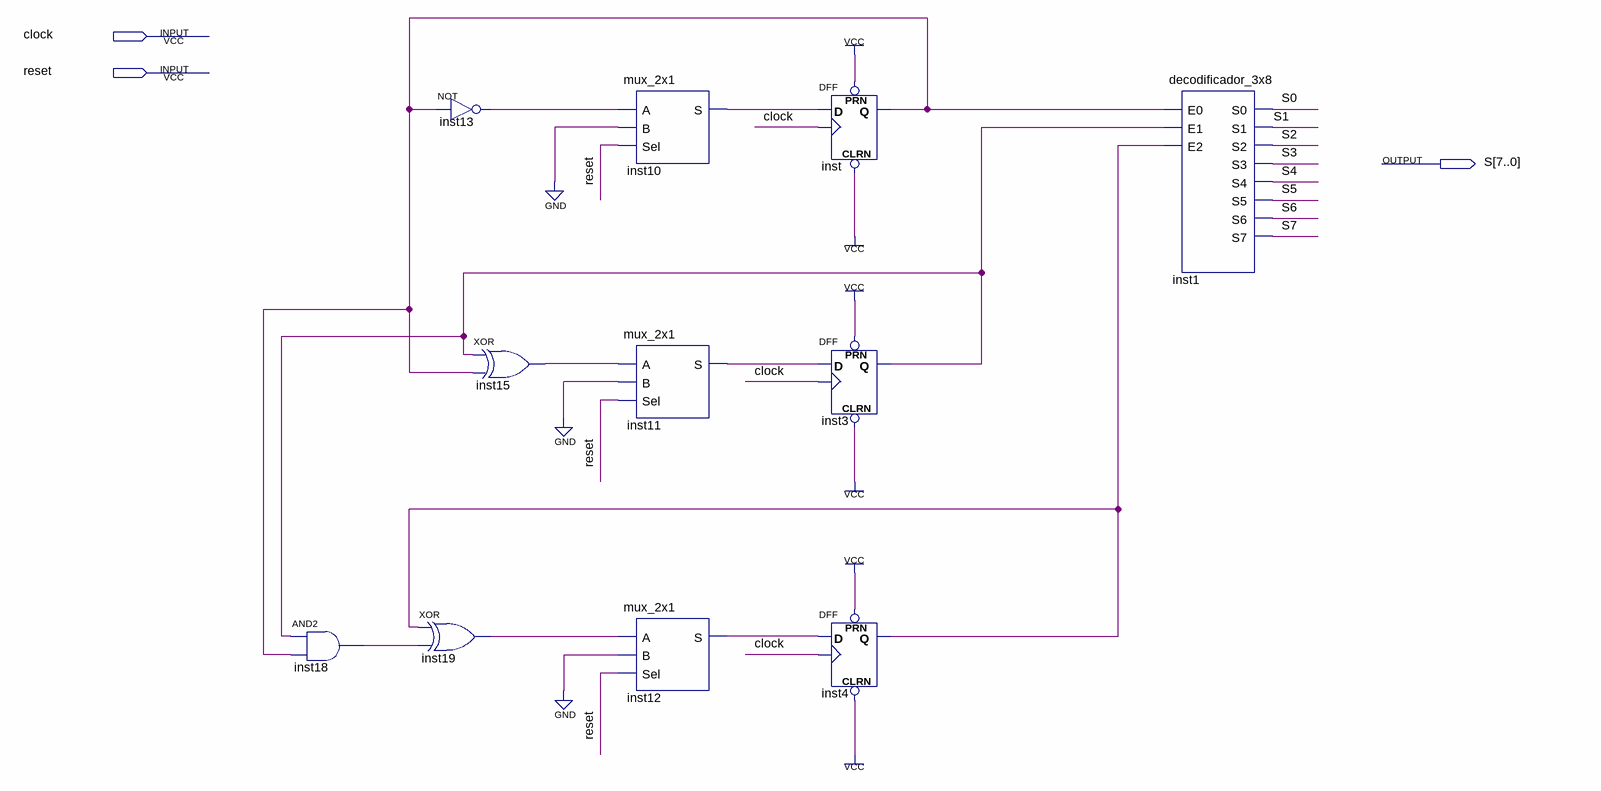
[diagram p0: schematic sheet]
// Quartus schematic temporizador.bdf as structural Verilog: 11 symbols, 3 pins
module temporizador (
  input  clock,
  input  reset,
  output [7:0] S
);

  wire inst3_q, inst4_q, inst10_s, inst11_s, inst12_s, inst13_out, inst15_out, inst18_out, inst19_out, inst_q;

  and inst18 (inst18_out, inst3_q, inst_q);
  not inst13 (inst13_out, inst_q);
  xor inst15 (inst15_out, inst3_q, inst_q);
  xor inst19 (inst19_out, inst4_q, inst18_out);
  mux_2x1 inst10 (.A(inst13_out), .B(1'b0), .Sel(reset), .S(inst10_s));
  mux_2x1 inst11 (.A(inst15_out), .B(1'b0), .Sel(reset), .S(inst11_s));
  mux_2x1 inst12 (.A(inst19_out), .B(1'b0), .Sel(reset), .S(inst12_s));
  DFF inst (.CLRN(1'b1), .CLK(clock), .D(inst10_s), .PRN(1'b1), .Q(inst_q));
  DFF inst3 (.CLRN(1'b1), .CLK(clock), .D(inst11_s), .PRN(1'b1), .Q(inst3_q));
  DFF inst4 (.CLRN(1'b1), .CLK(clock), .D(inst12_s), .PRN(1'b1), .Q(inst4_q));
  decodificador_3x8 inst1 (
    .E0(inst_q), .E1(inst3_q), .E2(inst4_q), .S0(S[0]), .S1(S[1]), .S2(S[2]), .S3(S[3]), .S4(S[4]),
    .S5(S[5]), .S6(S[6]), .S7(S[7]));
endmodule
